# EAGLE design IO4-QuadAnalogSwitch (EAGLE 7.7.0)
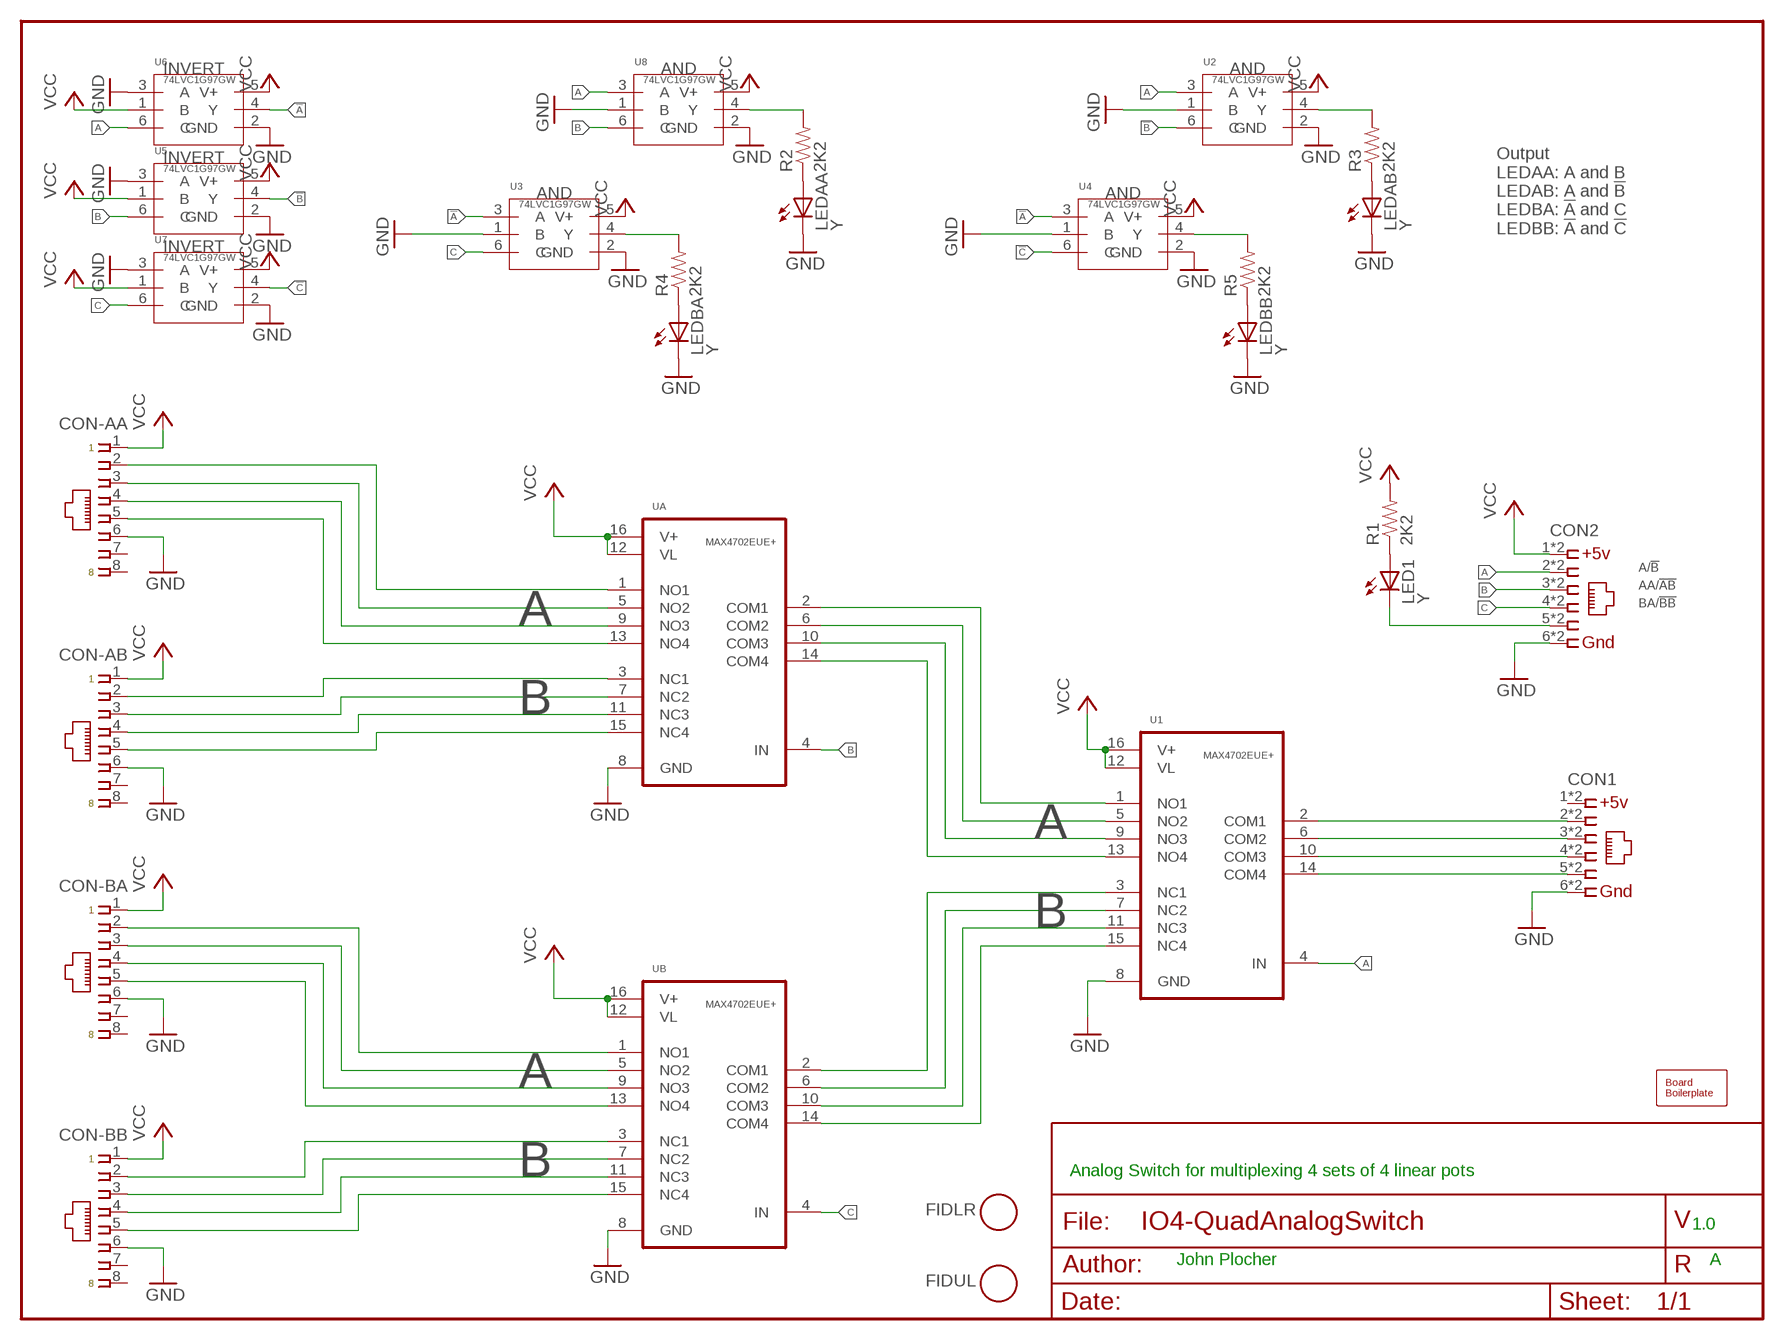
[diagram p0: schematic, sheet 1]

## Parts
BOARD1  BOARD80X100  [BOARD-DINRAIL-3.17INX10CM]
CON1  CONNECTOR-IO4IPINS  [RJ24-INVERTED-PINS]
CON2  CONNECTOR-IO4IPINS  [RJ24-INVERTED-PINS]
CON-AA  CONNECTOR-RJ45-FRONT  [RJ45-NO-SHIELD]
CON-AB  CONNECTOR-RJ45-FRONT  [RJ45-NO-SHIELD]
CON-BA  CONNECTOR-RJ45-FRONT  [RJ45-NO-SHIELD]
CON-BB  CONNECTOR-RJ45-FRONT  [RJ45-NO-SHIELD]
FIDLR  FIDUCIAL  [FIDUCIAL_1MM]
FIDUL  FIDUCIAL  [FIDUCIAL_1MM]
LED1  Y  LED0603-LED  [0603-LED]
LEDAA  Y  LED0603-LED  [0603-LED]
LEDAB  Y  LED0603-LED  [0603-LED]
LEDBA  Y  LED0603-LED  [0603-LED]
LEDBB  Y  LED0603-LED  [0603-LED]
R1  2K2  R0603-RES  [0603-RES]
R2  2K2  R0603-RES  [0603-RES]
R3  2K2  R0603-RES  [0603-RES]
R4  2K2  R0603-RES  [0603-RES]
R5  2K2  R0603-RES  [0603-RES]
U1  MAX4702EUE+  [MAX4702EUE+]
U2  74LVC1G97GW  [SOT363]
U3  74LVC1G97GW  [SOT363]
U4  74LVC1G97GW  [SOT363]
U5  74LVC1G97GW  [SOT363]
U6  74LVC1G97GW  [SOT363]
U7  74LVC1G97GW  [SOT363]
U8  74LVC1G97GW  [SOT363]
UA  MAX4702EUE+  [MAX4702EUE+]
UB  MAX4702EUE+  [MAX4702EUE+]

## Nets
!A: U3.3(A) U4.3(A) U6.4(Y)
!B: U2.6(C) U5.4(Y)
!C: U4.6(C) U7.4(Y)
A: CON2.2 CON2.2@1 U1.4(IN) U2.3(A) U6.6(C) U8.3(A)
A1: U1.1(NO1) UA.2(COM1)
A2: U1.5(NO2) UA.6(COM2)
A3: U1.9(NO3) UA.10(COM3)
A4: U1.13(NO4) UA.14(COM4)
AA1: CON-AA.2 UA.1(NO1)
AA2: CON-AA.3 UA.5(NO2)
AA3: CON-AA.4 UA.9(NO3)
AA4: CON-AA.5 UA.13(NO4)
AB1: CON-AB.2 UA.3(NC1)
AB2: CON-AB.3 UA.7(NC2)
AB3: CON-AB.4 UA.11(NC3)
AB4: CON-AB.5 UA.15(NC4)
B: CON2.3 CON2.3@1 U5.6(C) U8.6(C) UA.4(IN)
B1: U1.3(NC1) UB.2(COM1)
B2: U1.7(NC2) UB.6(COM2)
B3: U1.11(NC3) UB.10(COM3)
B4: U1.15(NC4) UB.14(COM4)
BA1: CON-BA.2 UB.1(NO1)
BA2: CON-BA.3 UB.5(NO2)
BA3: CON-BA.4 UB.9(NO3)
BA4: CON-BA.5 UB.13(NO4)
BB1: CON-BB.2 UB.3(NC1)
BB2: CON-BB.3 UB.7(NC2)
BB3: CON-BB.4 UB.11(NC3)
BB4: CON-BB.5 UB.15(NC4)
C: CON2.4 CON2.4@1 U3.6(C) U7.6(C) UB.4(IN)
COM1: CON1.2 CON1.2@1 U1.2(COM1)
COM2: CON1.3 CON1.3@1 U1.6(COM2)
COM3: CON1.4 CON1.4@1 U1.10(COM3)
COM4: CON1.5 CON1.5@1 U1.14(COM4)
GND: CON1.6 CON1.6@1 CON2.6 CON2.6@1 CON-AA.6 CON-AB.6 CON-BA.6 CON-BB.6 LEDAA.C LEDAB.C LEDBA.C LEDBB.C U1.8(GND) U2.1(B) U2.2(GND) U3.1(B) U3.2(GND) U4.1(B) U4.2(GND) U5.2(GND) U5.3(A) U6.2(GND) U6.3(A) U7.2(GND) U7.3(A) U8.1(B) U8.2(GND) UA.8(GND) UB.8(GND)
N$7: LED1.A R1.1
N$8: CON2.5 CON2.5@1 LED1.C
N$9: LEDAA.A R2.1
N$16: LEDBB.A R5.1
N$17: LEDAB.A R3.1
N$18: R2.2 U8.4(Y)
N$19: LEDBA.A R4.1
N$20: R5.2 U4.4(Y)
N$22: R4.2 U3.4(Y)
N$25: R3.2 U2.4(Y)
VCC: CON2.1 CON2.1@1 CON-AA.1 CON-AB.1 CON-BA.1 CON-BB.1 R1.2 U1.12(VL) U1.16(V+) U2.5(V+) U3.5(V+) U4.5(V+) U5.1(B) U5.5(V+) U6.1(B) U6.5(V+) U7.1(B) U7.5(V+) U8.5(V+) UA.12(VL) UA.16(V+) UB.12(VL) UB.16(V+)
Unconnected: CON-AA.7 CON-AA.8 CON-AB.7 CON-AB.8 CON-BA.7 CON-BA.8 CON-BB.7 CON-BB.8

## Notes on the sheet
- INVERT | AND | AND
- INVERT
- AND | AND
- Output
  LEDAA: A and B
  LEDAB: A and !B!
  LEDBA: !A! and C
  LEDBB: !A! and !C!
- INVERT
- A/!B
- AA/!AB
- BA/!BB
- A
- B
- A
- B
- A
- B | Analog Switch for multiplexing 4 sets of 4 linear pots
- 1.0
- John Plocher | A

## Power pins joined to a net without a drawn wire
1: CON1.1 CON1.1@1

## Library data of the parts
BOARD1 = SPCoast:BOARD
CON1 CON2 = SPCoast:CONNECTOR-IO4
CON-AA CON-AB CON-BA CON-BB = SPCoast:CONNECTOR-RJ45: Tyco CORCOM Modular RJ Jacks No Shield; AMP: 520151-4; OPL: none
FIDLR FIDUL = SPCoast:FIDUCIAL: For use by pick and place machines to calibrate the vision/machine, 1mm By microbuilder.eu
LED1 LEDAA LEDAB LEDBA LEDBB = SPCoast:LED*
R1-R5 = SPCoast:R*: Resistor Basic schematic elements and footprints for 0603, 1206, and PTH 1/10th watt (small) resistors.
U1 UA UB = SPCoast:MAX4702
U2-U8 = SPCoast:74LVC1G97GW

## Board
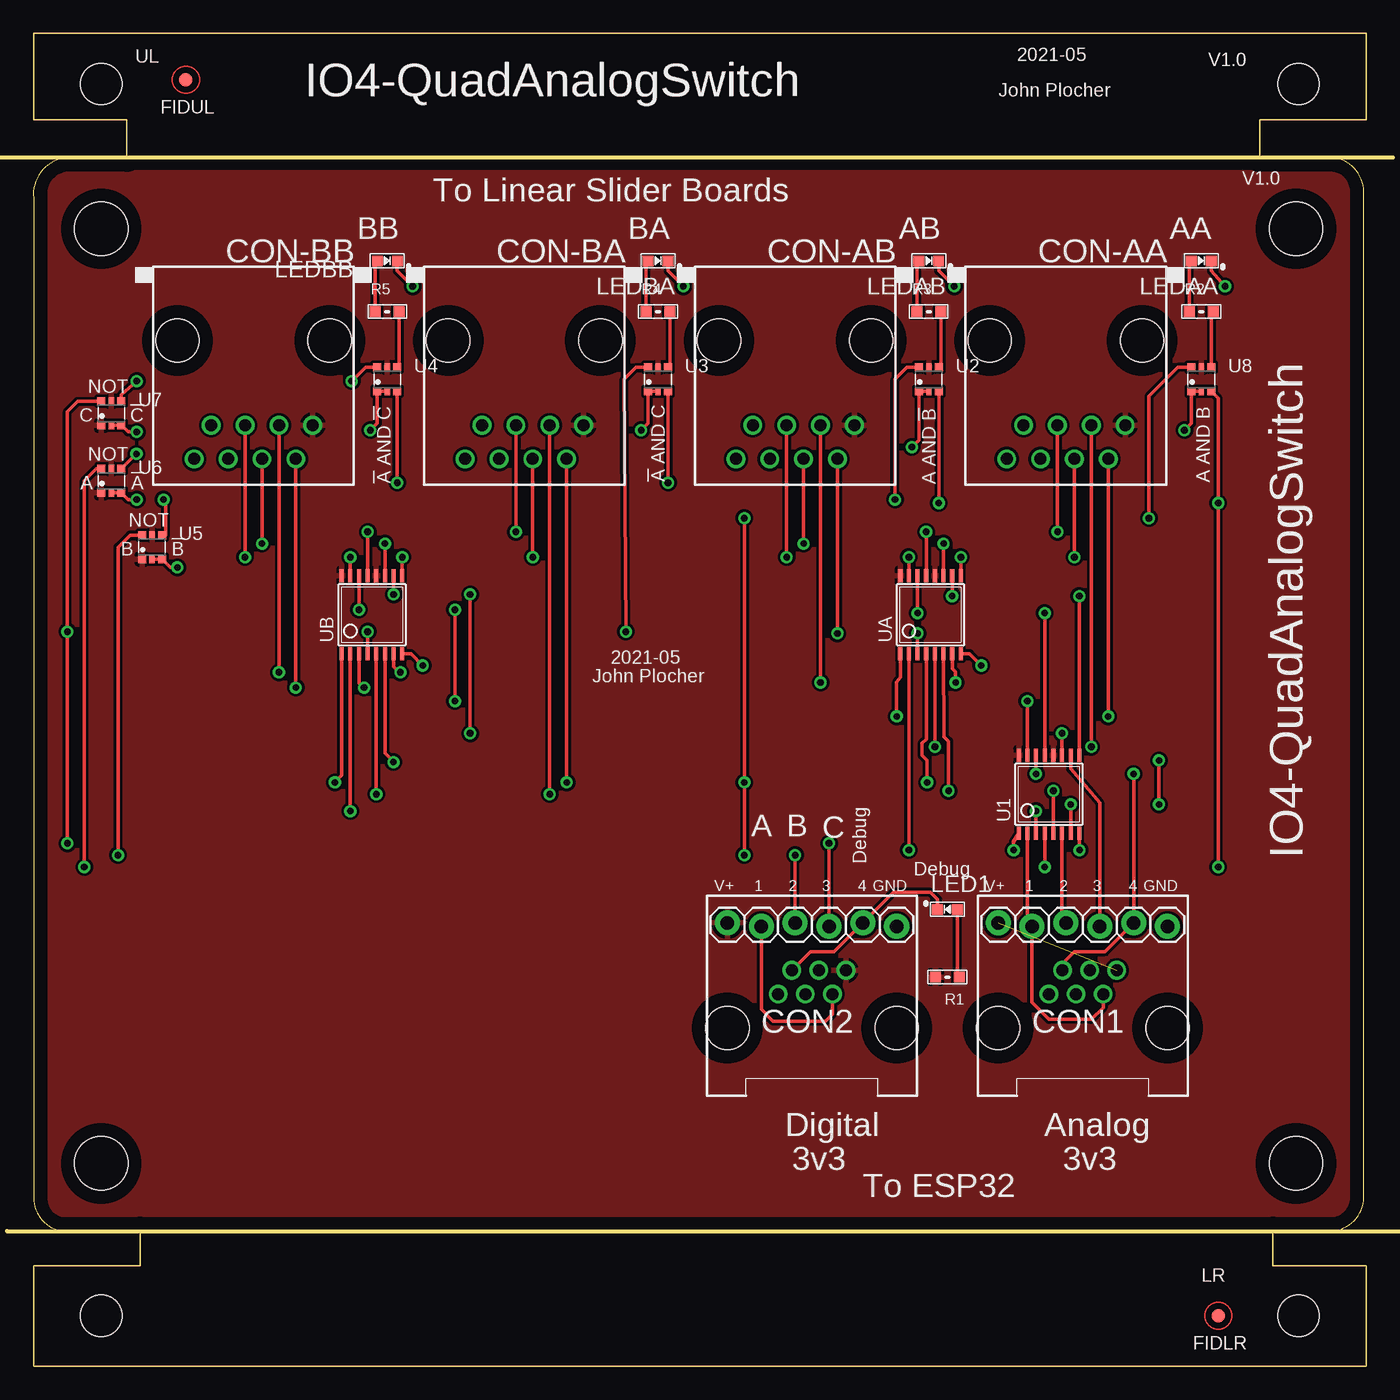
[diagram p1: board, top side]
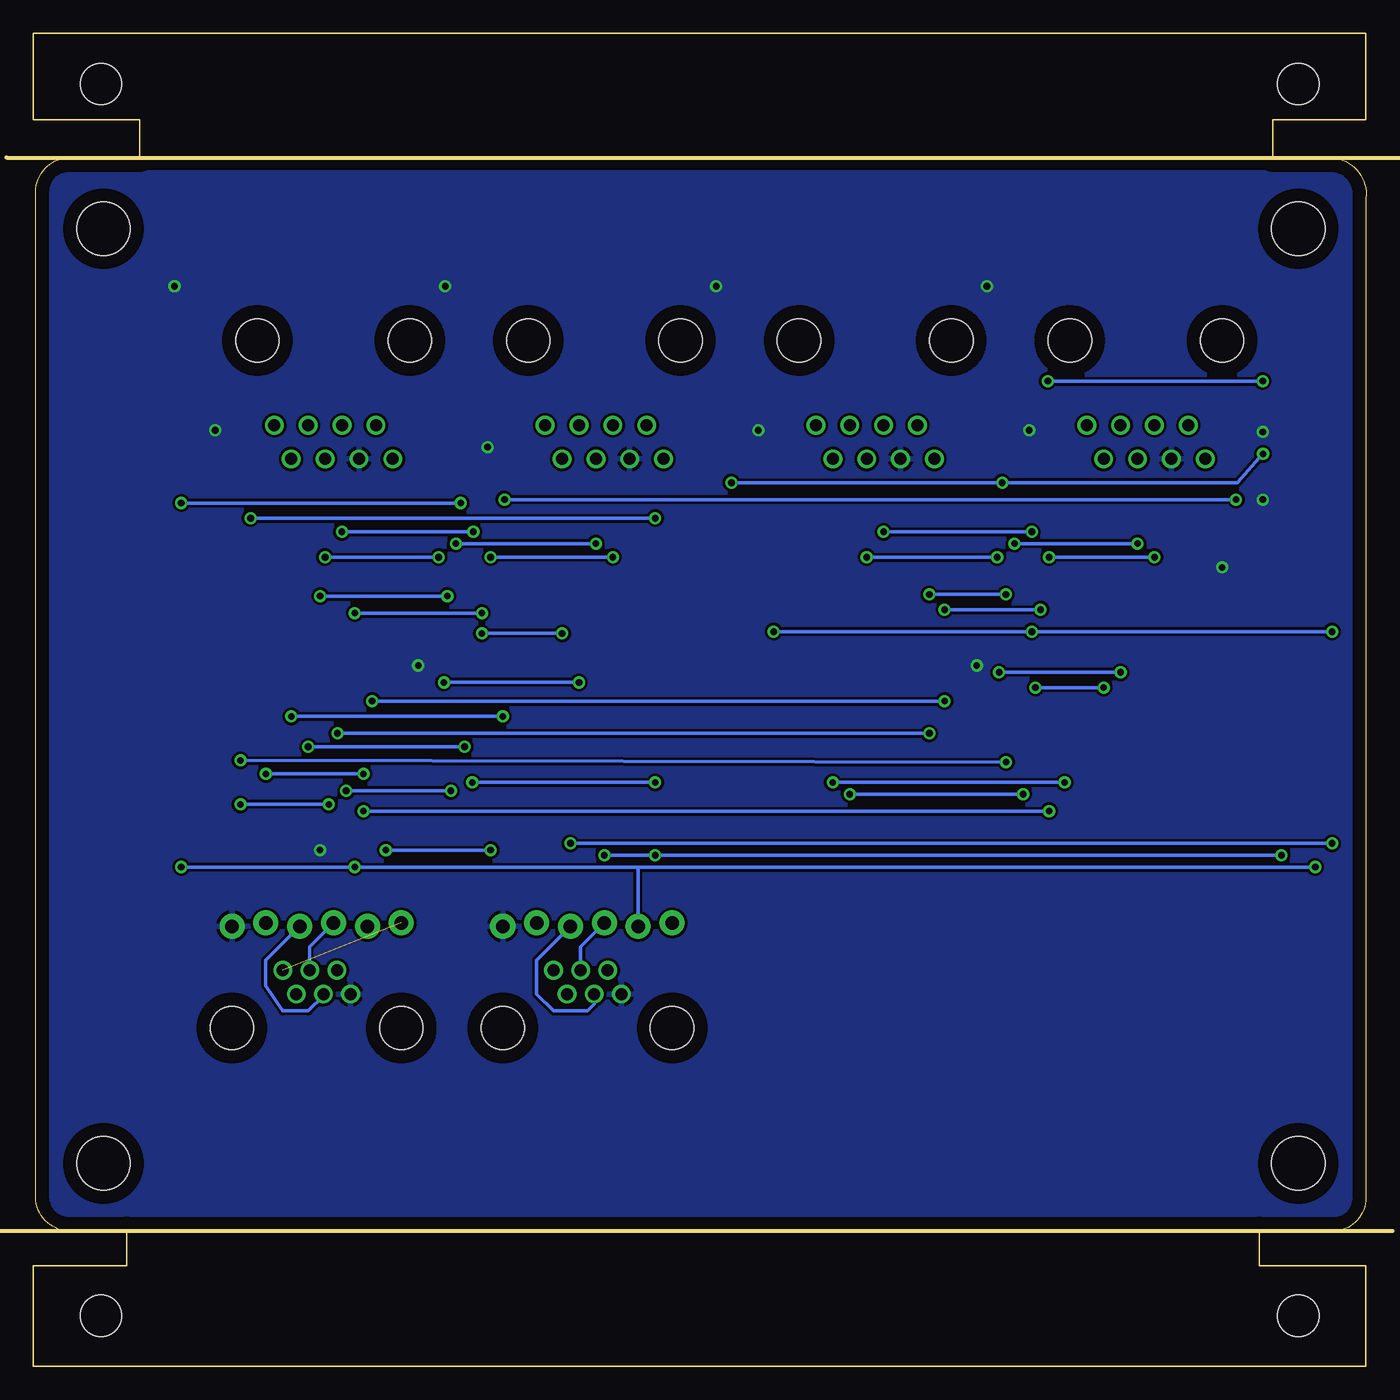
[diagram p2: board, bottom side, seen from below]

Size 100.01 x 100 mm. Coordinates in mm from the lower left corner, seen from the top.
Copper layers (1*16): Top 0.035mm / dielectric 1.5mm / Bottom 0.035mm
Design rules "default *": minimum track width 10mil, minimum drill 0.5mm, track to track 8mil, track to pad 8mil, pad to pad 8mil, via to via 8mil, smd to smd 8mil, copper to edge 40mil, drill to drill 8mil, minimum pad ring 10mil, minimum via ring 8mil, stop-mask expansion 4mil, vias tented up to drill 0mil, thermal gap 10mil

### Footprints (pad centres in the part's own frame; a part is rotated, then mirrored left to right if it is on the bottom)
BOARD-DINRAIL-3.17INX10CM = hole 4: 94.742,15.24; 5.08,85.344; 94.742,85.344; 5.08,15.24 | hole 3.1: 5.08,96.19; 94.92,96.19; 5.08,3.81; 94.92,3.81
RJ24-INVERTED-PINS = drill 1.016 pad 1.88: 1 6.35,-4.064; 2 3.81,-3.81; 3 1.27,-4.064; 4 -1.27,-3.81; 5 -3.81,-4.064; 6 -6.35,-3.81 | drill 0.9 pad 1.4: 1@1 -2.54,-0.508; 2@1 -1.524,1.27; 3@1 -0.508,-0.508; 4@1 0.508,1.27; 5@1 1.524,-0.508; 6@1 2.54,1.27 | hole 3.251: 6.35,3.81; -6.35,3.81
RJ45-NO-SHIELD = drill 0.9 pad 1.4: 1 -4.445,6.35; 2 -3.175,8.89; 3 -1.905,6.35; 4 -0.635,8.89; 5 0.635,6.35; 6 1.905,8.89; 7 3.175,6.35; 8 4.445,8.89 | hole 3.251: -5.715,0; 5.715,0
FIDUCIAL_1MM = smd 1 x 1: 1 0,0
0603-LED = smd 0.8 x 0.8: A 0.75,0; C -0.75,0
0603-RES = smd 0.813 x 0.813: 1 -0.9,0; 2 0.9,0
MAX4702EUE+ = smd 0.305 x 0.991: 1 -2.275,-2.918; 2 -1.625,-2.918; 3 -0.975,-2.918; 4 -0.325,-2.918; 5 0.325,-2.918; 6 0.975,-2.918; 7 1.625,-2.918; 8 2.275,-2.918; 9 2.275,2.918; 10 1.625,2.918; 11 0.975,2.918; 12 0.325,2.918; 13 -0.325,2.918; 14 -0.975,2.918; 15 -1.625,2.918; 16 -2.275,2.918
SOT363 = smd 0.6 x 0.6: 1 -0.75,-0.9; 3 0.75,-0.9; 4 0.75,0.9; 6 -0.75,0.9 | smd 0.4 x 0.6: 2 0,-0.9; 5 0,0.9

### Placement (x,y rotation side)
BOARD1  0.01,0 0 top
CON1  78.75,29.21 180 top
CON2  58.43,29.21 180 top
CON-AA  77.48,76.96 180 top
CON-AB  57.16,76.96 180 top
CON-BA  36.84,76.96 180 top
CON-BB  16.52,76.96 180 top
FIDLR  88.91,3.81 0 top
FIDUL  11.44,96.52 0 top
LED1  68.59,34.29 0 top
LEDAA  87.64,82.93 180 top
LEDAB  67.2,82.93 180 top
LEDBA  46.88,82.93 180 top
LEDBB  26.56,82.93 180 top
R1  68.59,29.21 180 top
R2  87.64,79.12 0 top
R3  67.2,79.12 0 top
R4  46.88,79.12 0 top
R5  26.56,79.12 0 top
U1  76.21,42.93 0 top
U2  67.2,74.04 0 top
U3  46.88,74.04 0 top
U4  26.56,74.04 0 top
U5  8.9,61.47 0 top
U6  5.86,66.42 0 top
U7  5.86,71.5 0 top
U8  87.64,74.04 0 top
UA  67.32,56.39 0 top
UB  25.41,56.39 0 top

### Tracks (layer width: path | path; a pad name or v marks a point on that pad's centre or on a via)
1  (1 unrouted)
!A  (via drill 0.5)
  Top 0.254: U6.4 v7.74,68.45 | v27.31,66.29 U4.3 | U3.3 v47.63,66.29
  Bottom 0.254: v7.74,68.45 7.76,68.45 9.67,66.29 v27.31,66.29 v47.63,66.29 47.77,66.29
!B  (via drill 0.5)
  Top 0.254: U5.4 9.92,62.37 9.92,65.15 v9.77,65.02 | v64.66,65.02 64.66,74.04 65.56,74.94 U2.6
  Bottom 0.254: v9.77,65.02 v64.66,65.02
!C  (via drill 0.5)
  Top 0.254: U4.6 24.92,74.94 v23.89,73.91 | v7.76,73.91 6.61,72.89 U7.4
  Bottom 0.254: v23.89,73.91 v7.76,73.91
A  (via drill 0.5)
  Top 0.254: U1.4 v75.89,37.47 | v3.82,37.47 3.82,66.42 4.72,67.32 U6.6 | CON2.2@1 59.96,26.42 59.45,25.91 55.51,25.91 54.62,26.8 CON2.2 | v88.91,37.47 v88.91,64.77 88.91,72.62 U8.3 | U2.3 v67.95,64.77
  Bottom 0.254: 54.62,37.47 v75.89,37.47 v88.91,37.47 | 54.62,37.47 v3.82,37.47 | CON2.2 54.62,37.47 | v67.95,64.77 v88.91,64.77
A1  (via drill 0.5)
  Top 0.254: U1.1 73.55,39.37 v73.56,38.73 | v65.7,38.73 UA.2
  Bottom 0.254: v73.56,38.73 v65.7,38.73
A2  (via drill 0.5)
  Top 0.254: UA.6 68.34,47.24 68.68,46.9 v68.68,43.18 | v76.54,43.18 U1.5
  Bottom 0.254: v68.68,43.18 v76.54,43.18
A3  (via drill 0.5)
  Top 0.254: U1.9 v78.49,57.78 | v68.95,57.78 UA.10
  Bottom 0.254: v78.49,57.78 v68.95,57.78
A4  (via drill 0.5)
  Top 0.254: U1.13 v75.89,56.52 | v66.35,56.52 UA.14
  Bottom 0.254: v75.89,56.52 v66.35,56.52
AA1  (via drill 0.5)
  Top 0.254: CON-AA.2 v80.66,48.77 | v64.78,48.77 64.78,51.31 65.05,51.69 UA.1
  Bottom 0.254: v80.66,48.77 v64.78,48.77
AA2  (via drill 0.5)
  Top 0.254: CON-AA.3 v79.39,46.48 | v67.65,46.48 UA.5
  Bottom 0.254: v79.39,46.48 v67.65,46.48
AA3  (via drill 0.5)
  Top 0.254: CON-AA.4 v78.12,60.71 | v69.6,60.71 UA.9
  Bottom 0.254: v78.12,60.71 v69.6,60.71
AA4  (via drill 0.5)
  Top 0.254: CON-AA.5 v76.85,62.61 | v67,62.61 UA.13
  Bottom 0.254: v76.85,62.61 v67,62.61
AB1  (via drill 0.5)
  Top 0.254: CON-AB.2 v60.34,54.99 | v66.35,54.99 UA.3
  Bottom 0.254: v60.34,54.99 v66.35,54.99
AB2  (via drill 0.5)
  Top 0.254: CON-AB.3 v59.07,51.31 | v69.2,51.31 69.2,52.1 68.97,52.32 UA.7
  Bottom 0.254: v59.07,51.31 v69.2,51.31
AB3  (via drill 0.5)
  Top 0.254: CON-AB.4 v57.8,61.72 | v68.3,61.72 UA.11
  Bottom 0.254: v57.8,61.72 v68.3,61.72
AB4  (via drill 0.5)
  Top 0.254: CON-AB.5 v56.53,60.71 | v65.7,60.71 UA.15
  Bottom 0.254: v56.53,60.71 v65.7,60.71
B  (via drill 0.5)
  Top 0.254: CON2.3 v57.16,38.35 | UA.4 67,47.05 66.69,46.74 66.69,45.85 67.07,45.47 v67.07,43.81 | v6.36,38.35 6.36,61.47 7.26,62.37 U5.6 | U8.6 85.88,74.94 83.71,72.77 v83.71,63.63 | v53.35,63.63 v53.35,43.81 v53.35,38.35
  Bottom 0.254: v57.16,38.35 v53.35,38.35 v6.36,38.35 | CON2.3 58.94,31.5 CON2.3@1 | v83.71,63.63 v53.35,63.63 | v67.07,43.81 v53.35,43.81
B1  (via drill 0.5)
  Top 0.254: U1.3 v75.24,41.66 | v23.79,41.66 UB.2
  Bottom 0.254: v75.24,41.66 v23.79,41.66
B2  (via drill 0.5)
  Top 0.254: U1.7 v77.84,42.16 | v84.47,42.16 v84.47,45.47 | v27.02,45.34 27.06,45.34 26.39,46.02 UB.6
  Bottom 0.254: v77.84,42.16 v84.47,42.16 | v84.47,45.47 v27.02,45.34
B3  (via drill 0.5)
  Top 0.254: U1.11 v77.19,47.5 | v32.78,47.5 v32.78,57.91 | v27.04,57.91 UB.10
  Bottom 0.254: v77.19,47.5 v32.78,47.5 | v32.78,57.91 v27.04,57.91
B4  (via drill 0.5)
  Top 0.254: U1.15 v74.59,49.91 | v31.64,49.91 v31.64,56.77 | v24.44,56.77 UB.14
  Bottom 0.254: v74.59,49.91 v31.64,49.91 | v31.64,56.77 v24.44,56.77
BA1  (via drill 0.5)
  Top 0.254: CON-BA.2 v40.02,43.81 | v22.63,43.81 22.75,43.94 23.14,44.33 UB.1
  Bottom 0.254: v40.02,43.81 v22.63,43.81
BA2  (via drill 0.5)
  Top 0.254: CON-BA.3 v38.75,42.93 | v25.74,42.93 UB.5
  Bottom 0.254: v38.75,42.93 v25.74,42.93
BA3  (via drill 0.5)
  Top 0.254: CON-BA.4 v37.48,60.71 | v27.69,60.71 UB.9
  Bottom 0.254: v37.48,60.71 v27.69,60.71
BA4  (via drill 0.5)
  Top 0.254: CON-BA.5 v36.21,62.61 | v25.09,62.61 UB.13
  Bottom 0.254: v36.21,62.61 v25.09,62.61
BB1  (via drill 0.5)
  Top 0.254: CON-BB.2 v19.7,50.93 | UB.3 24.44,51.27 24.78,50.93 v24.82,50.93
  Bottom 0.254: v19.7,50.93 v24.82,50.93
BB2  (via drill 0.5)
  Top 0.254: CON-BB.3 v18.43,52.07 | v27.55,52.07 27.45,52.07 27.04,52.48 UB.7
  Bottom 0.254: v18.43,52.07 v27.55,52.07
BB3  (via drill 0.5)
  Top 0.254: CON-BB.4 v17.16,61.72 | v26.39,61.72 UB.11
  Bottom 0.254: v17.16,61.72 v26.39,61.72
BB4  (via drill 0.5)
  Top 0.254: CON-BB.5 v15.89,60.71 | v23.79,60.71 UB.15
  Bottom 0.254: v15.89,60.71 v23.79,60.71
C  (via drill 0.5)
  Top 0.254: CON2.4 v59.7,39.24 | v2.55,39.24 v2.55,55.12 2.55,71.63 3.32,72.39 U7.6 | v25.09,55.12 UB.4 | v44.46,55.12 44.34,74.04 45.24,74.94 U3.6
  Bottom 0.254: v59.7,39.24 v2.55,39.24 | CON2.4 62.24,30.48 62.24,27.94 60.97,26.67 58.43,26.67 57.93,27.18 CON2.4@1 | v2.55,55.12 v25.09,55.12 v44.46,55.12
COM1
  Top 0.254: CON1.2@1 80.28,26.92 79.39,26.04 76.21,26.04 74.94,27.3 CON1.2 74.59,33.38 U1.2
COM2
  Top 0.254: U1.6 77.19,33.57 CON1.3
  Bottom 0.254: CON1.3@1 79.26,31.5 CON1.3
COM3
  Top 0.254: CON1.4 80.02,42.29 77.84,44.83 U1.10
  Bottom 0.254: CON1.4@1 78.25,27.81 79.39,26.67 81.29,26.67 82.56,28.57 82.56,30.48 CON1.4
COM4  (via drill 0.5)
  Top 0.254: CON1.5@1 77.23,30.23 78.12,31.11 80.4,31.11 CON1.5 v82.56,44.45 | v75.24,44.45 U1.14
  Bottom 0.254: v82.56,44.45 v75.24,44.45
GND  (via drill 0.5)
  Top 0.254: v25.29,70.23 25.81,70.75 U4.1 U4.2 | LEDBB.C 27.31,82.18 v28.46,81.03 | LEDBA.C 47.63,82.18 v48.78,81.03 | LEDAB.C 67.95,82.18 v69.1,81.03 | LEDAA.C 88.39,82.18 v89.42,81.03 | v86.37,70.23 86.89,70.75 U8.1 U8.2 | v65.93,68.96 66.45,69.48 U2.1 U2.2 | v45.61,70.23 46.13,70.75 U3.1 U3.2 | U1.8 78.49,39 v78.5,38.73 | UA.8 70.24,53.47 v71.13,52.58 | UB.8 28.33,53.47 v29.22,52.58 | U5.2 U5.3 10.28,59.94 v10.81,59.94 | U6.2 U6.3 7.1,65.02 v7.76,65.02 | U7.2 U7.3 7.1,70.1 v7.76,70.1
  pour Bottom: 0.01,89.53 100.34,89.53 100.34,11.43 0.01,11.43
N$7
  Top 0.254: R1.1 69.34,29.21 LED1.A
N$8
  Top 0.254: LED1.C 67.84,35.04 67.32,35.56 64.53,35.56 CON2.5 60.08,31.11 58.31,31.11 CON2.5@1
N$9
  Top 0.254: R2.1 86.74,82.78 LEDAA.A
N$16
  Top 0.254: R5.1 25.66,82.78 LEDBB.A
N$17
  Top 0.254: R3.1 66.3,82.78 LEDAB.A
N$18
  Top 0.254: R2.2 88.39,78.97 U8.4
N$19
  Top 0.254: R4.1 45.98,82.78 LEDBA.A
N$20
  Top 0.254: R5.2 27.46,75.09 U4.4
N$22
  Top 0.254: R4.2 47.78,74.94 U3.4
N$25
  Top 0.254: R3.2 68.1,74.94 U2.4
VCC
  pour Top: 0.01,89.53 100.34,89.53 100.34,11.43 0.01,11.43

### Text on the board
tPlace: UL | 2021-05 | V1.0 | John Plocher | V1.0 | To Linear Slider Boards | BB | BA | AB | AA | NOT | C | !C | !A! AND !C | !A! AND C | A AND !B | A AND B | NOT | A | !A | NOT | B | !B | 2021-05 | John Plocher | A | B | C | Debug | Debug | Digital | Analog | 3v3 | 3v3 | To ESP32 | LR